# EAGLE design DA_uno_shield_0_9 (EAGLE 7.5.0)
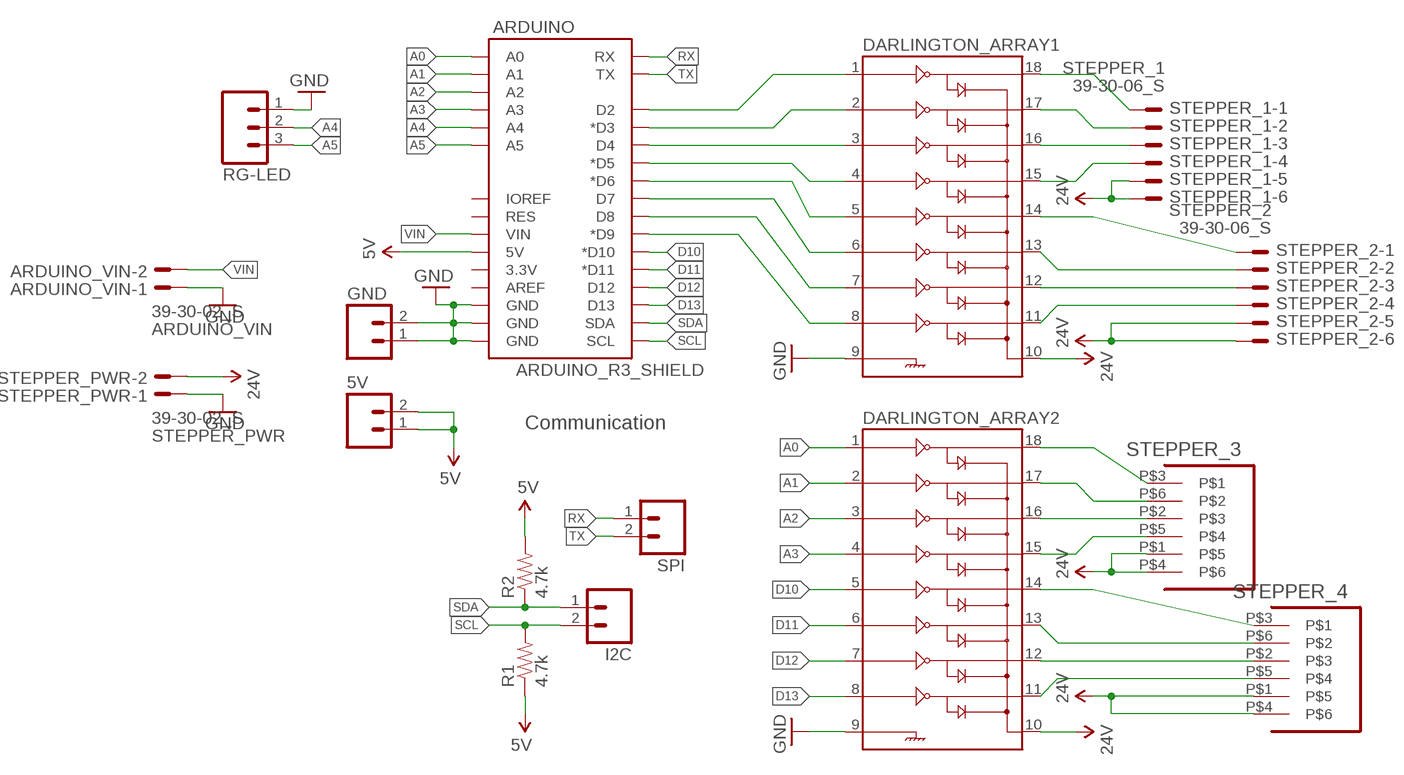
[diagram p0: schematic, sheet 1]

## Parts
5V  M021X02_NO_SILK  [1X02_NO_SILK]
ARDUINO  ARDUINO_R3_SHIELD  [UNO_R3_SHIELD]
ARDUINO_VIN  39-30-02_S  [39-30-?02?]
DARLINGTON_ARRAY1  ULN2803DIP  [DIL18]
DARLINGTON_ARRAY2  ULN2803DIP  [DIL18]
GND  M021X02_NO_SILK  [1X02_NO_SILK]
I2C  M021X02_NO_SILK  [1X02_NO_SILK]
R1  4.7k  RESISTORKIT  [AXIAL-0.3-KIT]
R2  4.7k  RESISTORKIT  [AXIAL-0.3-KIT]
RG-LED  M03LOCK_NO_SILK  [1X03_LOCK_NO_SILK]
SPI  M021X02_NO_SILK  [1X02_NO_SILK]
STEPPER_1  39-30-06_S  [39-30-?06?]
STEPPER_2  39-30-06_S  [39-30-?06?]
STEPPER_3  39-29-06  [39-29-?06?]
STEPPER_4  39-29-06  [39-29-?06?]
STEPPER_PWR  39-30-02_S  [39-30-?02?]

## Nets
5V: 5V.1 5V.2 ARDUINO.5V R1.P$1 R2.P$2
A0: ARDUINO.A0 DARLINGTON_ARRAY2.1
A1: ARDUINO.A1 DARLINGTON_ARRAY2.2
A2: ARDUINO.A2 DARLINGTON_ARRAY2.3
A3: ARDUINO.A3 DARLINGTON_ARRAY2.4
A4: ARDUINO.A4 RG-LED.2
A5: ARDUINO.A5 RG-LED.3
D10: ARDUINO.D10(*D10) DARLINGTON_ARRAY2.5
D11: ARDUINO.D11(*D11) DARLINGTON_ARRAY2.6
D12: ARDUINO.D12 DARLINGTON_ARRAY2.7
D13: ARDUINO.D13 DARLINGTON_ARRAY2.8
GND: ARDUINO.GND@0(GND) ARDUINO.GND@1(GND) ARDUINO.GND@2(GND) ARDUINO_VIN.1 DARLINGTON_ARRAY1.9 DARLINGTON_ARRAY2.9 GND.1 GND.2 RG-LED.1 STEPPER_PWR.1
N$1: DARLINGTON_ARRAY1.14 STEPPER_2.1
N$2: DARLINGTON_ARRAY1.13 STEPPER_2.2
N$3: DARLINGTON_ARRAY1.12 STEPPER_2.3
N$4: DARLINGTON_ARRAY1.11 STEPPER_2.4
N$5: ARDUINO.D6(*D6) DARLINGTON_ARRAY1.5
N$6: ARDUINO.D7 DARLINGTON_ARRAY1.6
N$7: ARDUINO.D8 DARLINGTON_ARRAY1.7
N$8: ARDUINO.D9(*D9) DARLINGTON_ARRAY1.8
N$30: DARLINGTON_ARRAY2.18 STEPPER_3.P$3
N$33: ARDUINO.D2 DARLINGTON_ARRAY1.1
N$34: DARLINGTON_ARRAY1.18 STEPPER_1.1
N$35: DARLINGTON_ARRAY1.17 STEPPER_1.2
N$36: DARLINGTON_ARRAY1.16 STEPPER_1.3
N$37: DARLINGTON_ARRAY1.15 STEPPER_1.4
N$38: ARDUINO.D3(*D3) DARLINGTON_ARRAY1.2
N$39: ARDUINO.D4 DARLINGTON_ARRAY1.3
N$40: ARDUINO.D5(*D5) DARLINGTON_ARRAY1.4
N$41: DARLINGTON_ARRAY2.17 STEPPER_3.P$6
N$42: DARLINGTON_ARRAY2.16 STEPPER_3.P$2
N$43: DARLINGTON_ARRAY2.15 STEPPER_3.P$5
N$44: DARLINGTON_ARRAY2.14 STEPPER_4.P$3
N$45: DARLINGTON_ARRAY2.13 STEPPER_4.P$6
N$46: DARLINGTON_ARRAY2.12 STEPPER_4.P$2
N$47: DARLINGTON_ARRAY2.11 STEPPER_4.P$5
RX: ARDUINO.RX SPI.1
SCL: ARDUINO.SCL I2C.2 R1.P$2
SDA: ARDUINO.SDA I2C.1 R2.P$1
TX: ARDUINO.TX SPI.2
VCC: DARLINGTON_ARRAY1.10 DARLINGTON_ARRAY2.10 STEPPER_1.5 STEPPER_1.6 STEPPER_2.5 STEPPER_2.6 STEPPER_3.P$1 STEPPER_3.P$4 STEPPER_4.P$1 STEPPER_4.P$4 STEPPER_PWR.2 ; supply symbol labelled 24V
VIN: ARDUINO.VIN ARDUINO_VIN.2
Unconnected: ARDUINO.3.3V ARDUINO.AREF ARDUINO.IOREF ARDUINO.RES

## Notes on the sheet
- Communication

## Library data of the parts
5V GND I2C SPI = SparkFun-Connectors:M02: Standard 2-pin 0.1" header. Use with - straight break away headers ( PRT-00116) - right angle break away headers (PRT-00553) - swiss pins (PRT-00743) - machine pins (PRT-00117) - female headers (PRT-00115) Molex polarized connector foot print use with: PRT-08233 with associated crimp pins and housings. 2.54_SCREWTERM for use with PRT-10571. 3.5mm Screw Terminal footprints for PRT-08084 5mm Screw Terminal footprints for use with PRT-08432
ARDUINO = Nathans-Arduinos:ARDUINO_R3_SHIELD: Shield form compatible with the Arduino Uno R3.
ARDUINO_VIN STEPPER_PWR = MTIID-molex-mini-fit-with-some-vertical:39-30-?02?_S: HEADER
DARLINGTON_ARRAY1 DARLINGTON_ARRAY2 = SparkFun-PowerIC:ULN2803: Darlington Driver ULN2803 Darlington array. 500mA max per channel, 8-channel package. Spark Fun Electronics SKU : COM-00312
R1 R2 = SparkFun-Resistors:RESISTOR: Resistor Basic schematic elements and footprints for 0603, 1206, and PTH resistors.
RG-LED = SparkFun-Connectors:M03: Header 3 Standard 3-pin 0.1" header. Use with straight break away headers (SKU : PRT-00116), right angle break away headers (PRT-00553), swiss pins (PRT-00743), machine pins (PRT-00117), and female headers (PRT-00115). Molex polarized connector foot print use with SKU : PRT-08232 with associated crimp pins and housings.
STEPPER_1 STEPPER_2 = MTIID-molex-mini-fit-with-some-vertical:39-30-?06?_S: HEADER
STEPPER_3 STEPPER_4 = MTIID-molex-mini-fit-with-some-vertical:39-29-?06?

## Net classes
0 default: width 0.559 mm, drill 0.381 mm, clearance 0.381 mm
1 GND: width 0.508 mm, drill 0.508 mm, clearance 0.381 mm

## Board
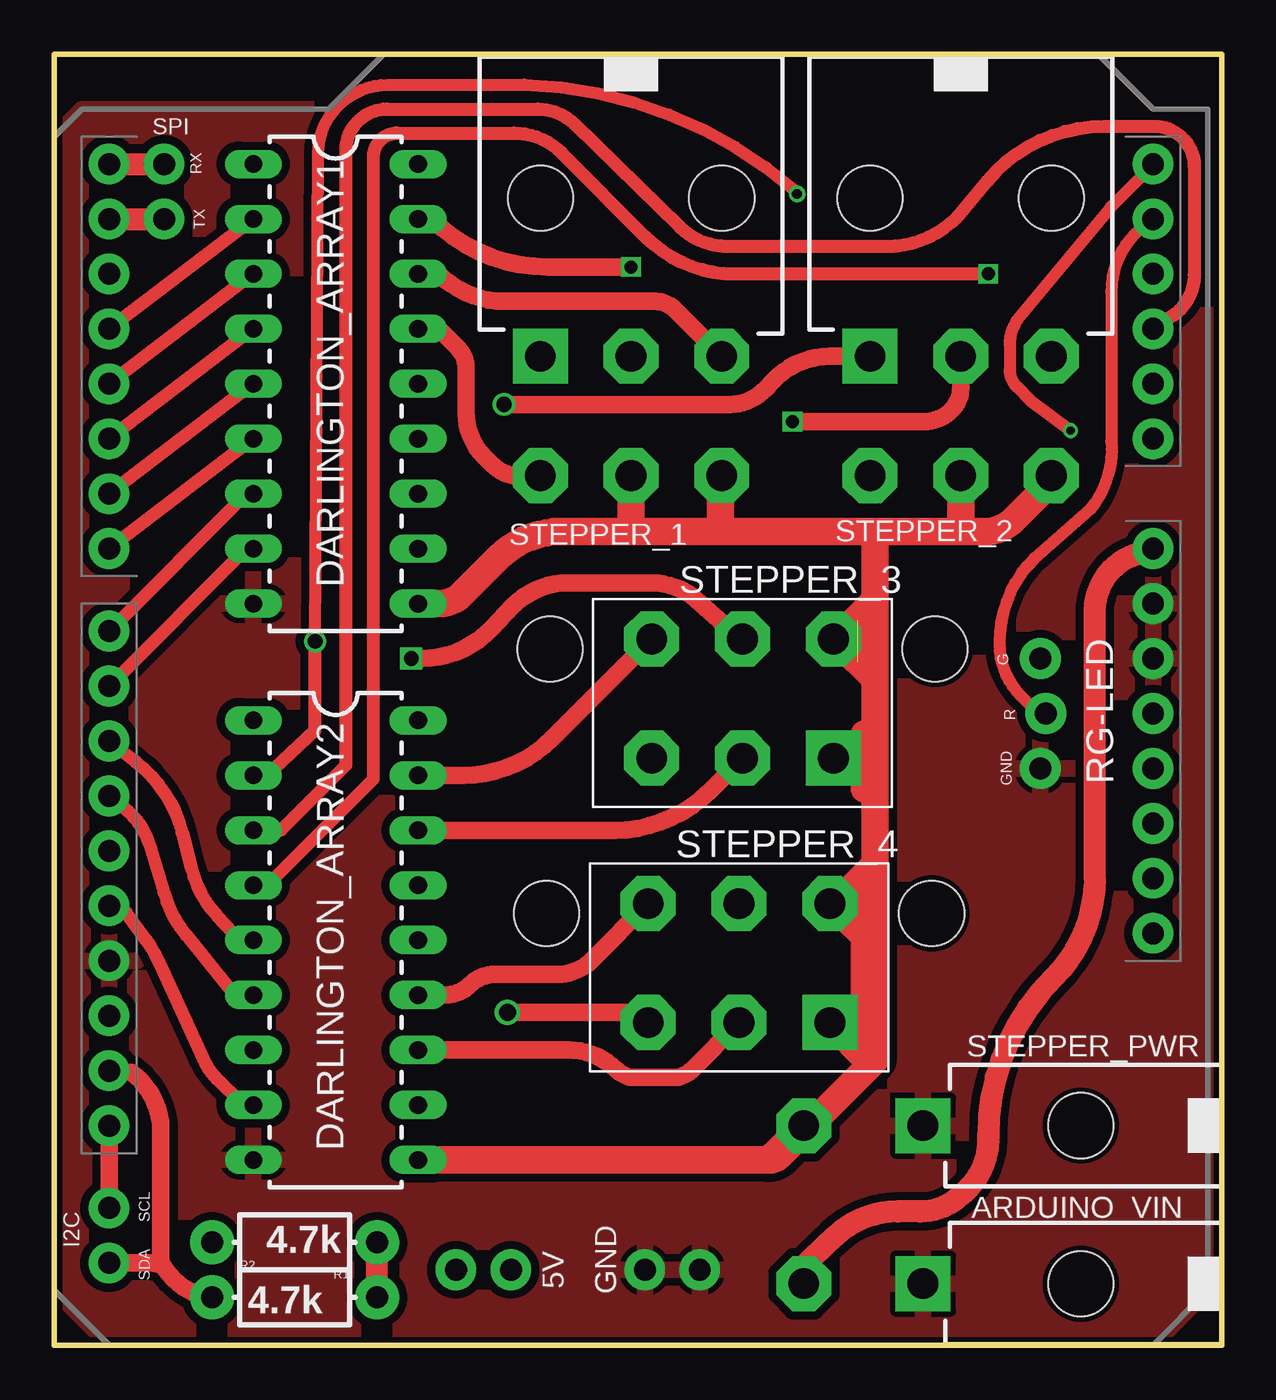
[diagram p1: board, top side]
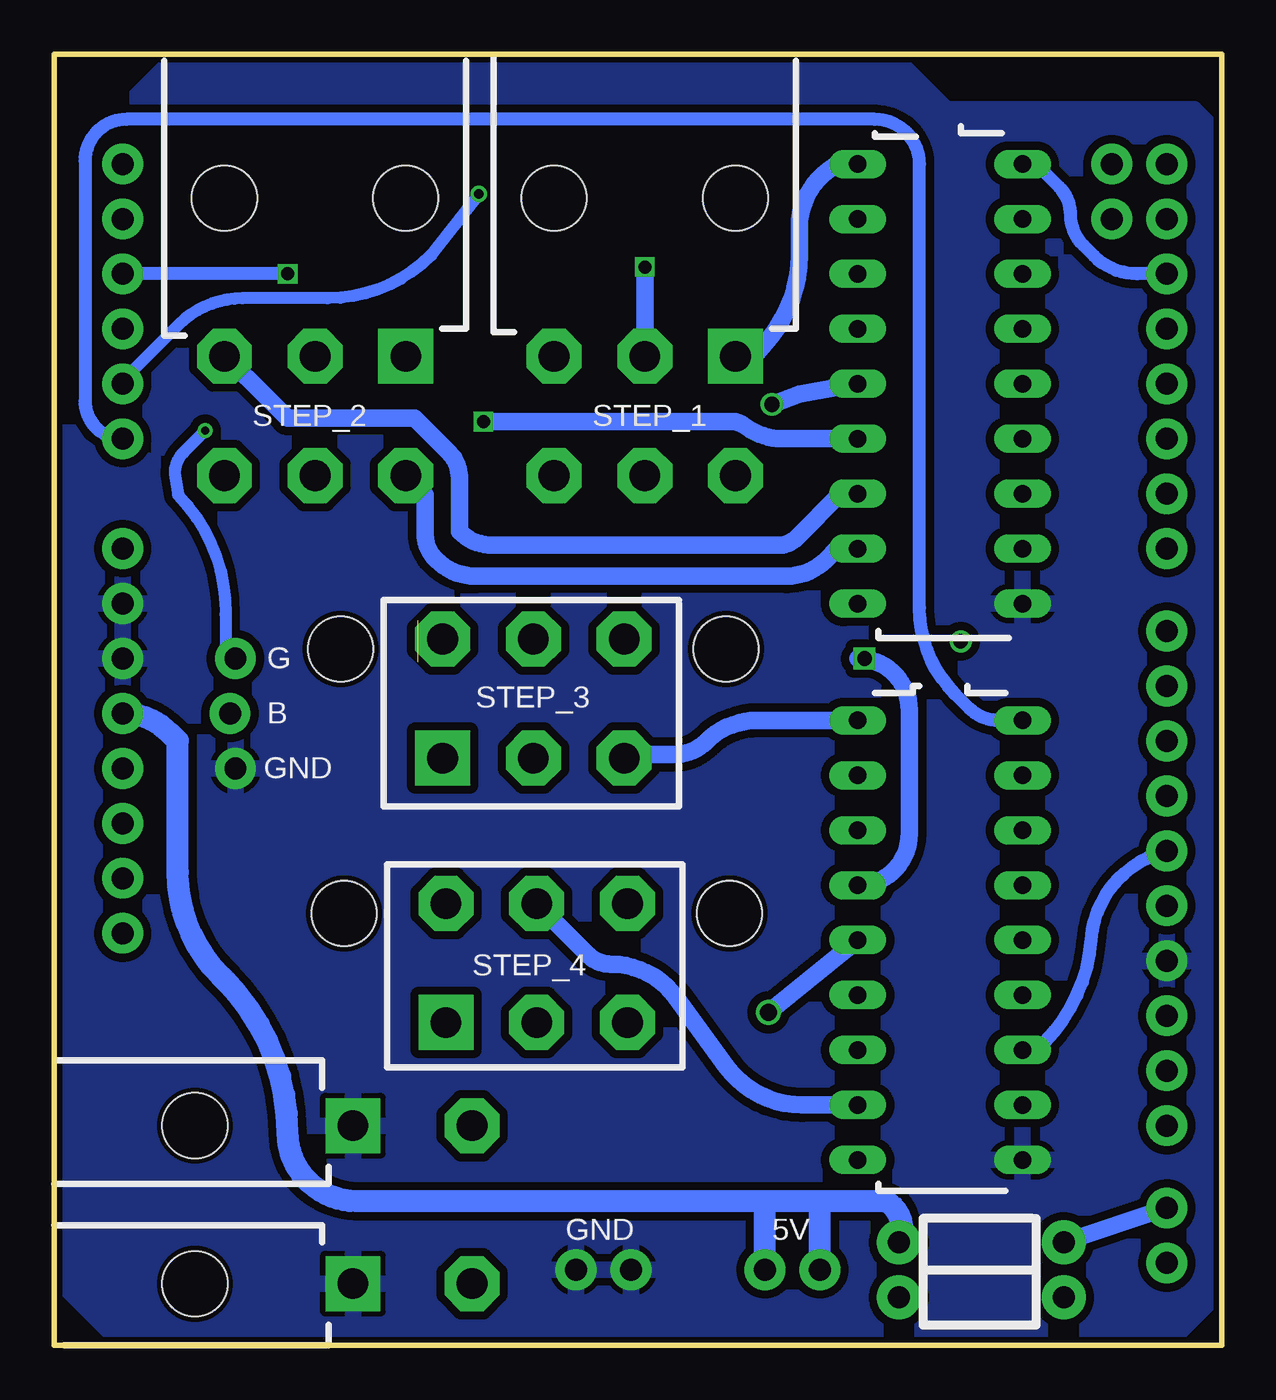
[diagram p2: board, bottom side, seen from below]

Size 53.98 x 59.69 mm. Coordinates in mm from the lower left corner, seen from the top.
Outline: 0,0 51.74,0
Outline: 0,0 53.98,0 53.98,59.69 0,59.69 0,0
Copper layers (1*16): Top 0.035mm / dielectric 1.5mm / Bottom 0.035mm
Design rules "SeeedStudio_2layer_DRU_no_angle_20140221": minimum track width 6mil, minimum drill 12mil, track to track 6mil, track to pad 6mil, pad to pad 6mil, via to via 6mil, smd to smd 0mil, copper to edge 10mil, drill to drill 10mil, minimum pad ring 10mil, minimum via ring 6mil, stop-mask expansion 2mil, vias tented up to drill 100mil, thermal gap 10mil

### Footprints (pad centres in the part's own frame; a part is rotated, then mirrored left to right if it is on the bottom)
1X02_NO_SILK = drill 1.016 pad 1.88: 1 0,0; 2 2.54,0
UNO_R3_SHIELD = drill 1.016 pad 1.88: 3.3V 50.8,26.67; 5V 50.8,29.21; A0 50.8,41.91; A1 50.8,44.45; A2 50.8,46.99; A3 50.8,49.53; A4 50.8,52.07; A5 50.8,54.61; AREF 2.54,15.24; D2 2.54,49.53; D3 2.54,46.99; D4 2.54,44.45; D5 2.54,41.91; D6 2.54,39.37; D7 2.54,36.83; D8 2.54,33.02; D9 2.54,30.48; D10 2.54,27.94; D11 2.54,25.4; D12 2.54,22.86; D13 2.54,20.32; GND@0 50.8,31.75; GND@1 50.8,34.29; GND@2 2.54,17.78; IOREF 50.8,21.59; NC 50.8,19.05; RES 50.8,24.13; RX 2.54,54.61; SCL 2.54,10.16; SDA 2.54,12.7; TX 2.54,52.07; VIN 50.8,36.83
39-30-?02? = drill 1.422 pad 2.54 square: 1 0,0 | drill 1.422 pad 2.54 octagon: 2 0,5.512 | hole 3: 0,-7.3
DIL18 = drill 0.813 long: 1 -10.16,-3.81; 2 -7.62,-3.81; 3 -5.08,-3.81; 4 -2.54,-3.81; 5 0,-3.81; 6 2.54,-3.81; 7 5.08,-3.81; 8 7.62,-3.81; 9 10.16,-3.81; 10 10.16,3.81; 11 7.62,3.81; 12 5.08,3.81; 13 2.54,3.81; 14 0,3.81; 15 -2.54,3.81; 16 -5.08,3.81; 17 -7.62,3.81; 18 -10.16,3.81
AXIAL-0.3-KIT = drill 1.016 pad 2.032: P$1 -3.81,0; P$2 3.81,0
1X03_LOCK_NO_SILK = drill 1.016 pad 1.88: 1 0,0.127; 2 2.54,-0.127; 3 5.08,0.127
39-30-?06? = drill 1.422 pad 2.54 square: 1 4.191,0 | drill 1.422 pad 2.54 octagon: 2 0,0; 3 -4.191,0; 4 4.191,5.512; 5 0,5.512; 6 -4.191,5.512 | hole 3: -4.191,-7.3; 4.191,-7.3
39-29-?06? = drill 1.422 pad 2.54 square: P$1 8.4,0 | drill 1.422 pad 2.54 octagon: P$2 4.2,0; P$3 0,0; P$4 8.4,5.5; P$5 4.2,5.5; P$6 0,5.5 | hole 3: -4.7,5.04; 13.1,5.04

### Placement (x,y rotation side)
5V  18.57,3.49 0 top
ARDUINO  0,0 0 top
ARDUINO_VIN  39-30-02?_S  [39-30-?02?]  40.16,2.86 90 top
DARLINGTON_ARRAY1  13.02,44.45 270 top
DARLINGTON_ARRAY2  13.02,18.73 270 top
GND  27.3,3.49 0 top
I2C  2.54,3.81 90 top
R1  11.11,4.76 180 top
R2  11.11,2.22 0 top
RG-LED  45.72,26.67 90 top
SPI  5.08,54.61 270 top
STEPPER_1  39-30-06?_S  [39-30-?06?]  26.67,45.72 180 top
STEPPER_2  39-30-06?_S  [39-30-?06?]  41.91,45.72 180 top
STEPPER_3  39-29-06?  [39-29-?06?]  27.62,27.15 0 top
STEPPER_4  39-29-06?  [39-29-?06?]  27.46,14.92 0 top
STEPPER_PWR  39-30-02?_S  [39-30-?02?]  40.16,10.16 90 top

### Tracks (layer width: path | path; a pad name or v marks a point on that pad's centre or on a via)
5V
  Top 1.016: R2.P$2 R1.P$1
  Bottom 1.016: R1.P$1 arc-90 15.56,6.67 18.57,6.67 | 18.57,6.67 21.11,6.67 | 21.11,6.67 40.01,6.67 arc90 43.18,9.84 arc-45 46.1,16.89 46.26,17.05 arc45 48.26,21.88 48.26,27.94 48.63,28.31 arc-45 ARDUINO.5V | 5V.1 18.57,6.67 | 5V.2 21.11,6.67
A0
  Bottom 0.61: DARLINGTON_ARRAY2.1 10.35,28.89 arc45 11.65,29.43 12.31,30.09 arc45 13.97,34.1 13.97,54.61 arc-90 16.03,56.67 50.63,56.67 arc-90 52.55,54.76 52.55,43.66 arc-90 ARDUINO.A0
A1  (via drill 0.46, 0.68)
  Top 0.559: v34.34,53.23 34.25,53.38 arc44 20.03,58.27 15.42,58.27 arc90 12.21,55.08 12.06,32.42 v12.06,32.54
  Top 0.61: DARLINGTON_ARRAY2.2 9.37,26.51 9.84,26.35 12.06,28.42 v12.06,32.54
  Bottom 0.559: v34.34,53.23 36.55,50.39 arc45 41.34,48.4 45.27,48.4 arc-45 48.2,47.19 50.75,44.64 ARDUINO.A1
A2
  Top 0.61: DARLINGTON_ARRAY2.3 10.48,23.81 13.49,26.83 13.49,55.24 arc-90 15.4,57.15 22.35,57.15 arc-44 24.04,56.46 28.92,51.7 arc44 31.14,50.8 38.49,50.8 arc50 42.01,52.46 43.14,53.82 arc-50 48.54,56.36 50.85,56.36 arc-90 52.7,54.5 52.7,49.48 arc-56 51.69,47.58 ARDUINO.A2
A3  (via drill 0.6)
  Top 0.61: DARLINGTON_ARRAY2.4 9.84,21.27 14.76,26.19 14.76,54.93 arc-90 15.88,56.04 21.25,56.04 arc-45 23.46,55.12 27.35,51.23 arc45 31.46,49.53 v43.18,49.53
  Bottom 0.61: v43.18,49.53 ARDUINO.A3
A4
  Top 0.559: RG-LED.2 45.58,29.6 45.11,29.6 44.69,30.03 arc-45 43.7,32.41 43.7,32.51 arc-45 45.3,36.38 47.88,38.63 arc45 48.87,41.8 48.87,48.71 arc-45 49.98,51.39 50.75,52.16 ARDUINO.A4
A5  (via drill 0.38)
  Top 0.559: v46.99,42.29 45.1,43.7 45.11,43.7 44.5,44.31 arc-45 44.17,45.1 44.17,46.27 arc-40 44.63,47.55 48.87,52.64 48.87,52.63 50.75,54.51 ARDUINO.A5
  Bottom 0.559: v46.99,42.29 47.98,41.3 arc-45 48.4,40.29 48.24,39.31 arc45 46.05,33.8 46.05,31.95 RG-LED.3
D10
  Top 0.61: ARDUINO.D10 3.75,27 arc-38 5.92,23.7 6.34,22.06 arc28 7.55,19.84 8.57,18.73 DARLINGTON_ARRAY2.5
D11
  Top 0.61: ARDUINO.D11 3.19,24.88 arc-35 4.47,22.98 5.08,20.92 arc22 6.1,18.97 8.1,16.51 DARLINGTON_ARRAY2.6
D12
  Bottom 0.61: DARLINGTON_ARRAY2.7 9.05,13.81 8.41,13.81 8.19,14.04 arc-41 6.03,18.73 arc72 ARDUINO.D12 2.64,22.86
D13
  Top 0.61: ARDUINO.D13 3.33,20 4.23,18.77 arc-11 4.87,17.68 6.9,13.24 arc20 7.56,12.28 8.57,11.27 DARLINGTON_ARRAY2.8
GND
  pour Bottom: 15.24,59.69 12.7,57.15 1.27,57.15 0,55.88 0,2.54 2.54,0 50.8,0 53.34,2.54 53.34,57.15 50.8,57.15 48.26,59.69
  pour Top: 1.27,57.15 0,55.88 0,2.54 2.54,0 50.8,0 53.34,2.54 53.34,57.15 50.8,57.15 48.26,59.69 15.24,59.69 12.7,57.15
N$1  (via drill 0.7)
  Top 0.813: v20.8,43.5 31.23,43.5 arc47 32.9,44.22 33.22,44.57 arc-47 35.86,45.72 STEPPER_2.1
  Bottom 0.813: DARLINGTON_ARRAY1.14 19.53,43.97 v20.8,43.5
N$2  (via drill 0.6)
  Top 0.813: v34.13,42.7 40.22,42.7 arc45 41.48,43.22 arc45 41.91,44.27 STEPPER_2.2
  Bottom 0.813: DARLINGTON_ARRAY1.13 20.35,41.91 arc32 21.76,42.31 22.16,42.56 arc-32 22.65,42.7 v34.13,42.7
N$3
  Bottom 0.813: DARLINGTON_ARRAY1.12 17.62,39.37 19.66,37.33 arc45 20.48,36.99 33.71,36.99 arc45 35.24,37.62 35.24,40.14 arc-45 35.71,41.27 37.31,42.86 43.18,42.86 44.93,44.61 45.72,45.34 STEPPER_2.3
N$4
  Bottom 0.813: DARLINGTON_ARRAY1.11 17.78,36.83 18.31,36.3 arc45 20.1,35.56 34.51,35.56 arc45 36.3,36.3 arc45 36.83,37.57 36.83,39.32 STEPPER_2.4
N$5
  Top 0.61: ARDUINO.D6 DARLINGTON_ARRAY1.5
N$6
  Top 0.61: ARDUINO.D7 DARLINGTON_ARRAY1.6
N$7
  Top 0.61: ARDUINO.D8 8.89,39.37 DARLINGTON_ARRAY1.7
N$8
  Top 0.61: ARDUINO.D9 8.89,36.83 DARLINGTON_ARRAY1.8
N$30
  Bottom 0.813: DARLINGTON_ARRAY2.18 21.46,28.89 arc-45 23.85,27.9 arc45 25.3,27.3 27.46,27.3 STEPPER_3.P$3
N$33
  Bottom 0.61: ARDUINO.D2 3.9,49.53 arc45 5.91,50.36 6.4,50.85 arc45 6.99,52.27 arc-45 7.52,53.56 8.57,54.61 DARLINGTON_ARRAY1.1
N$34
  Bottom 0.813: DARLINGTON_ARRAY1.18 17.78,54.61 18.18,54.32 arc-54 19.53,51.67 19.53,50.39 arc39 20.87,46.6 21.59,45.72 STEPPER_1.1
N$35  (via drill 0.6)
  Top 0.813: DARLINGTON_ARRAY1.17 17.46,52.07 arc45 22.83,49.85 v26.67,49.85
  Bottom 0.813: v26.67,49.85 STEPPER_1.2
N$36
  Top 0.813: DARLINGTON_ARRAY1.16 17.78,49.53 arc45 20.85,48.26 27.77,48.26 arc-45 28.71,47.87 STEPPER_1.3
N$37
  Top 0.813: DARLINGTON_ARRAY1.15 17.78,46.99 18.68,46.09 arc-45 19.05,45.19 19.05,43.09 arc45 19.88,41.08 20.23,40.73 arc45 21.59,40.16 22.43,40.16 STEPPER_1.4
N$38
  Top 0.61: ARDUINO.D3 DARLINGTON_ARRAY1.2
N$39
  Top 0.61: ARDUINO.D4 DARLINGTON_ARRAY1.3
N$40
  Top 0.61: ARDUINO.D5 DARLINGTON_ARRAY1.4
N$41
  Top 0.813: 27.94,33.02 27.62,32.7 STEPPER_3.P$6 23.05,28.07 arc-45 18.9,26.35 DARLINGTON_ARRAY2.17
N$42
  Top 0.813: DARLINGTON_ARRAY2.16 25.91,23.81 arc45 30.31,25.63 STEPPER_3.P$2
N$43  (via drill 0.68)
  Top 0.813: v16.51,31.75 16.97,31.75 arc46 20.22,33.14 21.18,34.14 arc-46 23.74,35.24 27.64,35.24 arc-42 29.7,34.46 31.73,32.65 STEPPER_3.P$5
  Bottom 0.813: v16.51,31.75 16.83,31.75 arc90 14.45,29.37 14.45,23.65 arc90 DARLINGTON_ARRAY2.15
N$44  (via drill 0.78)
  Top 0.813: v20.95,15.4 27.46,15.4 STEPPER_4.P$3
  Bottom 0.813: DARLINGTON_ARRAY2.14 v20.95,15.4
N$45
  Top 0.813: DARLINGTON_ARRAY2.13 18.06,16.19 arc45 19.21,16.67 arc-45 20.36,17.14 23.23,17.14 arc45 24.87,17.82 STEPPER_4.P$6
N$46
  Top 0.813: DARLINGTON_ARRAY2.12 23.78,13.65 arc-45 26,12.73 arc45 26.85,12.38 28.62,12.38 arc45 29.48,12.74 STEPPER_4.P$2
N$47
  Bottom 0.813: DARLINGTON_ARRAY2.11 19.4,11.11 arc54 22.88,12.88 25.24,16.1 arc-54 28.24,17.62 arc45 29.3,18.06 STEPPER_4.P$5
RX
  Top 1.016: ARDUINO.RX SPI.1
SCL
  Top 0.813: ARDUINO.SCL I2C.2
  Bottom 0.813: I2C.2 R1.P$2
SDA
  Top 0.813: ARDUINO.SDA 3.57,12.63 arc-45 4.92,10.32 4.92,3.81 4.45,3.81 | 4.45,3.81 5,3.73 arc45 7.02,2.22 R2.P$1 | I2C.1 4.45,3.81
TX
  Top 1.016: ARDUINO.TX SPI.2
VCC  (2 unrouted)
  Top 0.559: 37.31,20.68 37.59,20.68 37.94,20.32 | 37.31,19.68 37.12,19.27 37.12,15.98 37.47,15.72 | 37.15,32.89 37.12,32.89 STEPPER_3.P$4 | 37.47,27.25 37.59,27.25 37.48,27.14
  Top 0.813: DARLINGTON_ARRAY1.10 17.78,34.29
  Top 1.27: 30.8,37.62 26.67,37.62 | 26.67,37.62 23.45,37.62 arc45 20.55,36.42 18.83,34.71 arc-45 17.83,34.29 DARLINGTON_ARRAY1.10 | STEPPER_1.5 26.67,37.62 | STEPPER_1.6 30.8,40.15 30.8,37.62 | 30.8,37.62 37.94,37.62 | 37.94,37.62 41.91,37.62 | 41.91,37.62 43.05,37.62 arc45 44.36,38.17 46.1,39.91 STEPPER_2.6 | STEPPER_2.5 41.91,37.62 | 37.94,32.65 37.94,34.45 | 37.94,34.45 37.94,37.62 | STEPPER_3.P$4 37.94,32.65 | 37.94,32.65 37.94,30.8 | 37.94,30.8 37.94,26.67 | 37.94,26.67 37.94,22.23 | 37.94,22.23 37.94,20.32 | 37.94,20.32 37.94,18.41 | 37.94,18.41 37.94,13.18 37.78,13.02 | 37.78,13.02 33.56,8.8 arc-45 33.02,8.57 | 33.02,8.57 DARLINGTON_ARRAY2.10 | STEPPER_4.P$1 37.77,13.02 37.78,13.02 | STEPPER_4.P$4 35.97,20.32 | 36.04,20.32 36.2,20.32 | 36.2,20.32 37.94,20.32 | STEPPER_3.P$1 37.47,27.15 37.48,27.14 37.94,26.67 | STEPPER_PWR.2 33.02,8.57 | 37.47,25.72 37.47,27.25 37.47,28.26 | 37.31,19.68 37.31,20.68 37.31,20.95 | 36.83,13.97 37.47,13.97 37.47,15.72 | 36.04,20.32 37.94,18.41 | 35.56,20.32 35.97,20.32 | 35.97,20.32 36.04,20.32 | 36.2,20.32 36.2,20.48 37.94,22.23 | 36.35,32.38 37.94,30.8 | 36.35,32.86 37.94,34.45
  Top 1.422: STEPPER_1.6 31.07,40.21
VIN
  Top 1.016: ARDUINO.VIN 49.93,36.54 arc27 48.95,35.94 48.92,35.91 arc45 48.1,33.92 48.1,21.61 arc-45 46.18,16.97 arc45 43.18,9.73 43.18,9.53 arc-47 42.13,7.12 41.9,6.92 arc-43 40.05,6.19 38.98,6.19 arc44 36.09,5.03 33.97,3.02 ARDUINO_VIN.2

### Text on the board
tNames: RX | TX | G | R | GND | SCL | SDA
bNames: STEP_1 | STEP_2 | G | STEP_3 | B | GND | STEP_4 | 5V | GND